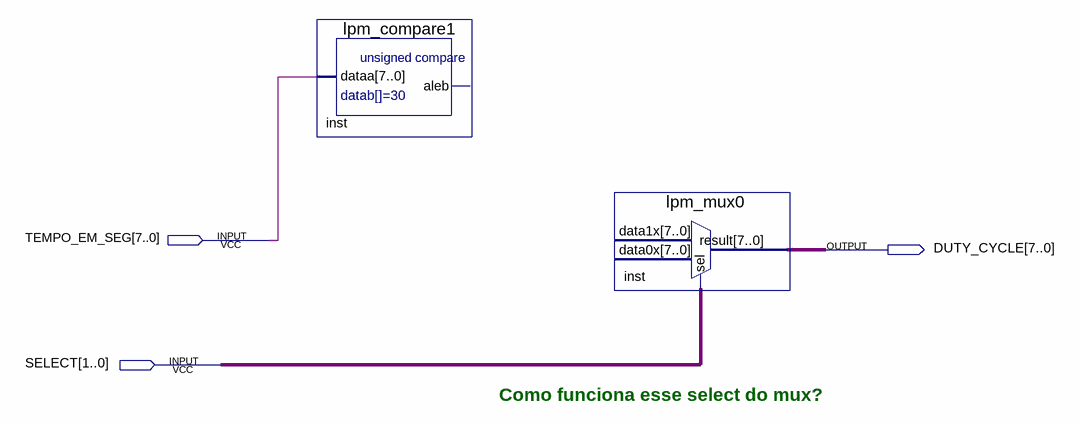
[diagram p0: schematic sheet]
// Quartus schematic curva.bdf as structural Verilog: 2 symbols, 3 pins
module curva (
  input  [7:0] TEMPO_EM_SEG,
  input  [1:0] SELECT,
  output [7:0] DUTY_CYCLE
);

  lpm_compare1 inst (.dataa(TEMPO_EM_SEG));  // open: aleb
  lpm_mux0 inst_dup2 (.sel(SELECT), .result(DUTY_CYCLE));  // open: data1x, data0x

  // Notes on the sheet:
  //   Como funciona esse select do mux?
endmodule
